# EAGLE board OpenBook-E-Book-Reader (EAGLE 9.7.0)
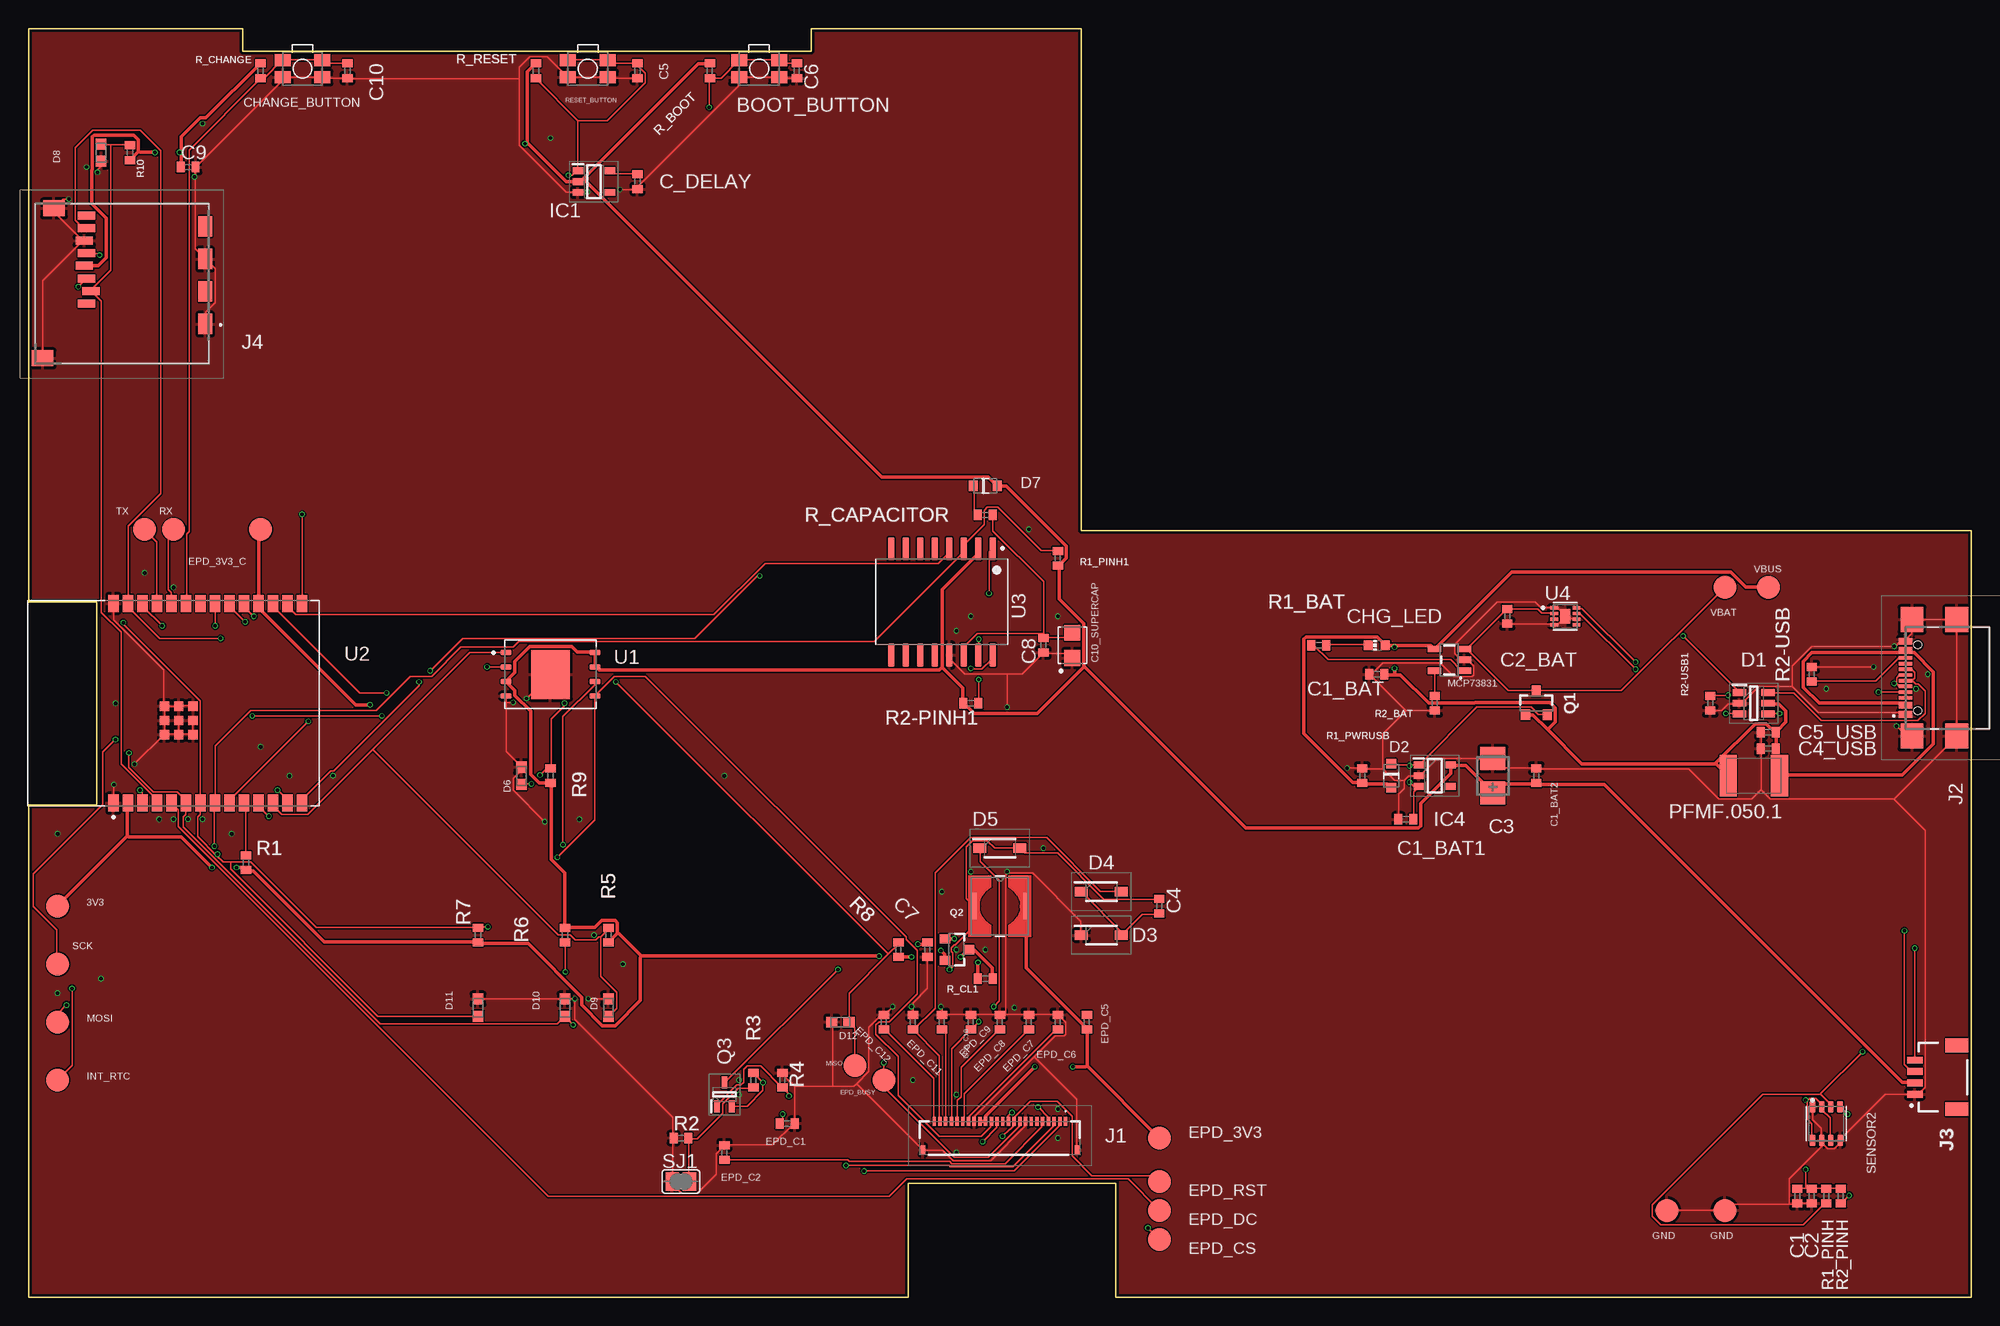
[diagram p1: board, top side]
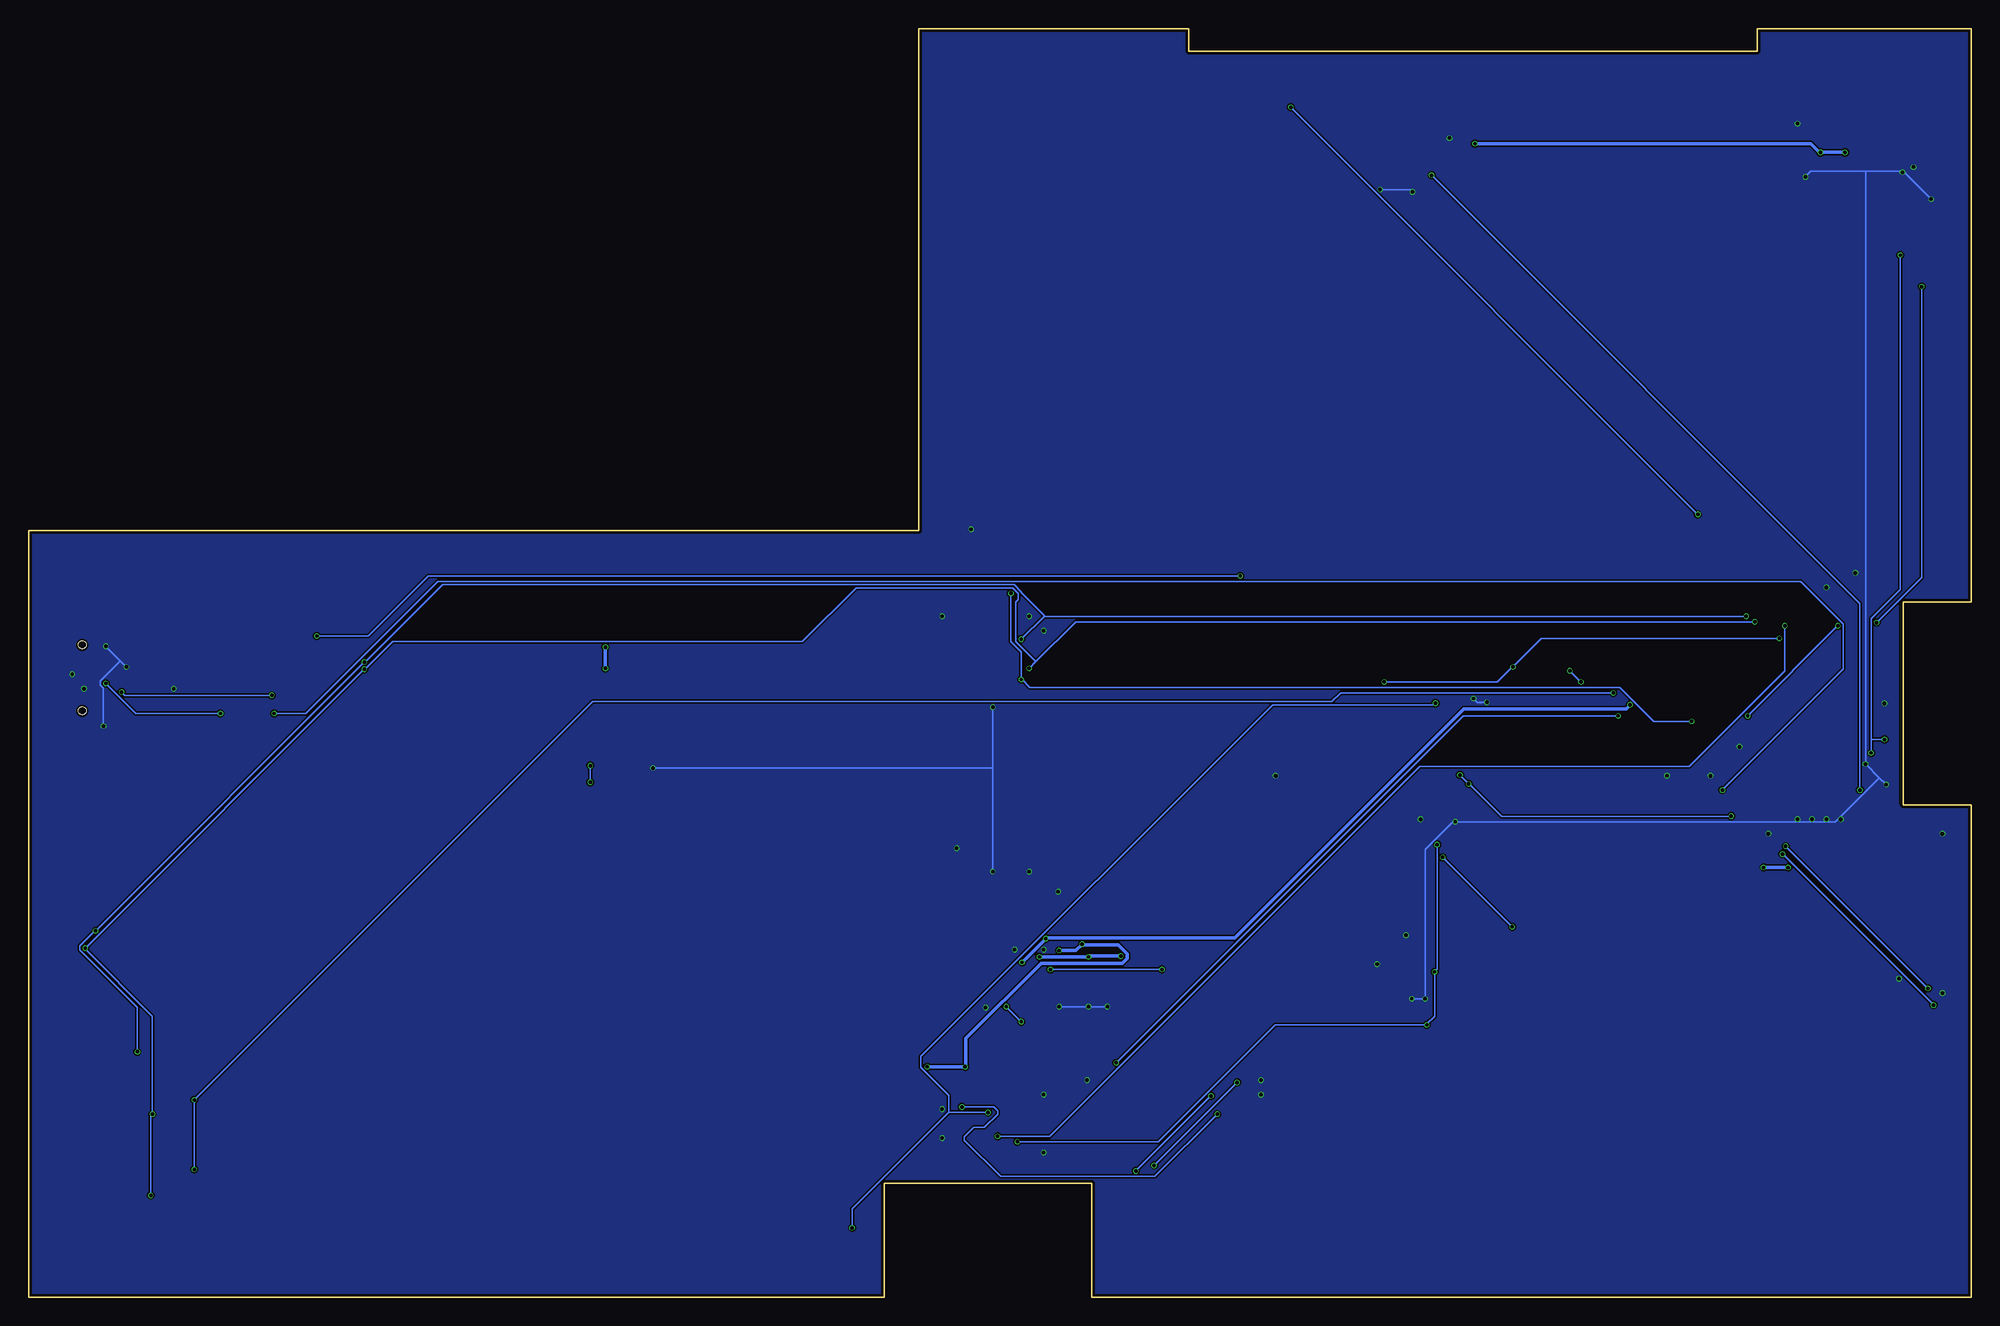
[diagram p2: board, bottom side, seen from below]

Size 170.2 x 111.2 mm. Coordinates in mm from the lower left corner, seen from the top.
Outline: 0,0 77.05,0 77.05,10 95.25,10 95.25,0 170.2,0 170.2,67.2 92.2,67.2 92.2,111.2 68.58,111.2 68.58,109.22 18.75,109.22 18.75,111.2 0,111.2 0,60.96 5.96,60.96 5.96,43.18 0,43.18 0,0
Copper layers (1*16): Top 0.035mm / dielectric 1.6mm / Bottom 0.035mm
Design rules "jlcpcb-2layers.dru *": minimum track width 0.15mm, minimum drill 0.3mm, track to track 5mil, track to pad 5mil, pad to pad 5mil, via to via 5mil, smd to smd 5mil, copper to edge 0.2mm, drill to drill 6mil, minimum pad ring 10mil, minimum via ring 3mil, stop-mask expansion 4mil, vias tented up to drill 0mil, thermal gap 10mil
Net classes: 1 ALIM: width 0.3 mm

## Footprints (pad centres in the part's own frame; a part is rotated, then mirrored left to right if it is on the bottom)
MYBUTTON = smd 1.4 x 1.05: 1 1.75,0.75; 2 -1.75,0.75; 3 -1.75,-0.75; 4 1.75,-0.75
ESP32_WROVER_EAGLE-LTSPICE_C0402 = smd 0.7 x 0.9: 1 -0.65,0; 2 0.65,0
RCL_CT3528 = smd 2 x 2.2: + -1.5,0; - 1.5,0
CAPCP3225X100N = smd 1.4 x 1.4: 1 -1.1,0; 2 1.1,0
ADAFRUIT_CHIP-LED0603 = smd 0.8 x 0.8: A 0,-0.75; C 0,0.75
SOT95P280X145-6N = smd 1.2 x 0.6: 1 -1.25,0.95; 2 -1.25,0; 3 -1.25,-0.95; 4 1.25,-0.95; 5 1.25,0; 6 1.25,0.95
ESP32_WROVER_AVX---SD0805S020S1R0_AVX_SD0805S020S1R0_0 = smd 0.8 x 0.9: 1 -1.05,0; 2 1.05,0
SOD3716X135N = smd 1.15 x 0.8: 1 -1.75,0; 2 1.75,0
DIOC1608X36N = smd 0.97 x 0.94: 1 -0.75,0; 2 0.75,0
SOT95P280X125-5N = smd 0.9 x 0.6: 1 -1.4,0.95; 2 -1.4,0; 3 -1.4,-0.95; 4 1.4,-0.95; 5 1.4,0.95
SOT95P280X120-5N = smd 0.9 x 0.6: 1 -1.4,0.95; 2 -1.4,0; 3 -1.4,-0.95; 4 1.4,-0.95; 5 1.4,0.95
FH34SRJ24S05SH99 = smd 0.3 x 0.8: 1 5.75,1.45; 2 5.25,1.45; 3 4.75,1.45; 4 4.25,1.45; 5 3.75,1.45; 6 3.25,1.45; 7 2.75,1.45; 8 2.25,1.45; 9 1.75,1.45; 10 1.25,1.45; 11 0.75,1.45; 12 0.25,1.45; 13 -0.25,1.45; 14 -0.75,1.45; 15 -1.25,1.45; 16 -1.75,1.45; 17 -2.25,1.45; 18 -2.75,1.45; 19 -3.25,1.45; 20 -3.75,1.45; 21 -4.25,1.45; 22 -4.75,1.45; 23 -5.25,1.45; 24 -5.75,1.45 | smd 0.4 x 0.8: MP1 6.75,-1.05; MP2 -6.75,-1.05
SAMACSYS_PARTS_USB4110GFA = smd 0.3 x 1.15: A1 -3.35,3.678; A4 -2.55,3.678; A5 -1.25,3.678; A6 -0.25,3.678; A7 0.25,3.678; A8 1.25,3.678; A9 2.55,3.678; A12 3.35,3.678; B1 3.05,3.678; B4 2.25,3.678; B5 1.75,3.678; B6 0.75,3.678; B7 -0.75,3.678; B8 -1.75,3.678; B9 -2.25,3.678; B12 -3.05,3.678 | smd 2.18 x 2: MP1 -5.11,-0.827; MP2 5.11,-0.827; MP3 -5.11,3.103; MP4 5.11,3.103 | hole 0.65: -2.89,2.603; 2.89,2.603
JST04_1MM_RA = smd 0.6 x 1.35: 1 -1.5,0; 2 -0.5,0; 3 0.5,0; 4 1.5,0 | smd 1.2 x 2: NC1 2.8,-3.675; NC2 -2.8,-3.675
112ATAARR03ATTEND = smd 1.8 x 1.2: G1 10.6,10.4; G2 4.9,10.4; S1 7.75,10.4; S2 2.05,10.4 | smd 1.4 x 1.9: G3 13.6,-3.85; G4 0.45,-2.85 | smd 0.7 x 1.5: P1 8.8,0; P2 7.7,0.4; P3 6.6,0; P4 5.5,-0.2; P5 4.4,0; P6 3.3,-0.2; P7 2.2,0; P8 1.1,0
IND_4828-WE-TPC_WRE = smd 0.508 x 2.286: 1 -2.286,0; 2 2.286,0
ESP32_WROVER_SPARKFUN-IC-POWER_SOT23-5 = smd 0.55 x 1.2: 1 -0.95,-1.3; 2 0,-1.3; 3 0.95,-1.3; 4 0.95,1.3; 5 -0.95,1.3
ESP32C6_VARISTOR_CT/CN1812 = smd 1.5 x 3.6: 1 -2.25,0; 2 2.25,0
ESP32_WROVER_SPARKFUN-DISCRETESEMI_SOT23-3 = smd 0.8 x 0.9: 1 -0.95,-1; 2 0.95,-1; 3 0,1.1
SOT65P210X110-3N = smd 1.05 x 0.5: 1 -1.05,0.65; 2 -1.05,-0.65; 3 1.05,0
ESP32_WROVER_EAGLE-LTSPICE_R0402 = smd 0.7 x 0.9: 1 -0.65,0; 2 0.65,0
ESP32_WROVER_BME680_PSON80P300X300X100-8N = smd 1.016 x 0.5: 1 1.458,1.2; 2 1.458,0.4; 3 1.458,-0.4; 4 1.458,-1.2; 5 -1.458,-1.22; 6 -1.458,-0.4; 7 -1.458,0.4; 8 -1.458,1.2
SJ = smd 1.168 x 1.6: 1 -0.762,0; 2 0.762,0
TP20R = smd 2 x 2: TP 0,0
SON127P600X800X80-9N = smd 0.94 x 0.44: 1 -3.895,1.905; 2 -3.895,0.635; 3 -3.895,-0.635; 4 -3.895,-1.905; 5 3.895,-1.905; 6 3.895,-0.635; 7 3.895,0.635; 8 3.895,1.905 | smd 3.4 x 4.3: 9 0,0
XCVR_ESP32-C6-WROOM-1-N8 = smd 1.5 x 0.9: 1 -8.75,5.26; 2 -8.75,3.99; 3 -8.75,2.72; 4 -8.75,1.45; 5 -8.75,0.18; 6 -8.75,-1.09; 7 -8.75,-2.36; 8 -8.75,-3.63; 9 -8.75,-4.9; 10 -8.75,-6.17; 11 -8.75,-7.44; 12 -8.75,-8.71; 13 -8.75,-9.98; 14 -8.75,-11.25; 15 8.75,-11.25; 16 8.75,-9.98; 17 8.75,-8.71; 18 8.75,-7.44; 19 8.75,-6.17; 20 8.75,-4.9; 21 8.75,-3.63; 22 8.75,-2.36; 23 8.75,-1.09; 24 8.75,0.18; 25 8.75,1.45; 26 8.75,2.72; 27 8.75,3.99; 28 8.75,5.26 | smd 0.8 x 0.8: 29_1 -2.755,0.79; 29_2 -1.505,0.79; 29_3 -0.255,0.79; 29_4 -2.755,-0.46; 29_5 -1.505,-0.46; 29_6 -0.255,-0.46; 29_7 -2.755,-1.71; 29_8 -1.505,-1.71; 29_9 -0.255,-1.71
SOIC127P1032X265-16N = smd 2.05 x 0.59: 1 -4.655,4.445; 2 -4.655,3.175; 3 -4.655,1.905; 4 -4.655,0.635; 5 -4.655,-0.635; 6 -4.655,-1.905; 7 -4.655,-3.175; 8 -4.655,-4.445; 9 4.655,-4.445; 10 4.655,-3.175; 11 4.655,-1.905; 12 4.655,-0.635; 13 4.655,0.635; 14 4.655,1.905; 15 4.655,3.175; 16 4.655,4.445
SON50P200X200X80-9N = smd 0.76 x 0.27: 1 -0.985,0.75; 2 -0.985,0.25; 3 -0.985,-0.25; 4 -0.985,-0.75; 5 0.985,-0.75; 6 0.985,-0.25; 7 0.985,0.25; 8 0.985,0.75 | smd 0.9 x 1.3: 9 0,0

## Placement (x,y rotation side)
BOOT_BUTTON  BUTTON_CUSYOMV1  [MYBUTTON]  64,107.67 180 top
C1  100nF  [ESP32_WROVER_EAGLE-LTSPICE_C0402]  154.94,8.89 270 top
C1_BAT  4.7uF  [ESP32_WROVER_EAGLE-LTSPICE_C0402]  118.11,54.61 180 top
C1_BAT1  4.7uF  [ESP32_WROVER_EAGLE-LTSPICE_C0402]  120.65,41.91 180 top
C1_BAT2  4.7uF  [ESP32_WROVER_EAGLE-LTSPICE_C0402]  132.08,45.72 90 top
C2  100nF  [ESP32_WROVER_EAGLE-LTSPICE_C0402]  156.21,8.89 270 top
C2_BAT  4.7uF  [ESP32_WROVER_EAGLE-LTSPICE_C0402]  129.54,59.69 270 top
C3  100uF TANT  [RCL_CT3528]  128.27,45.72 90 top
C4  4.7uF/25V  [ESP32_WROVER_EAGLE-LTSPICE_C0402]  99.06,34.29 90 top
C4_USB  100nF  [ESP32_WROVER_EAGLE-LTSPICE_C0402]  152.4,48.1 180 top
C5  1uF  [ESP32_WROVER_EAGLE-LTSPICE_C0402]  53.34,107.5 270 top
C5_USB  4.7uF  [ESP32_WROVER_EAGLE-LTSPICE_C0402]  152.4,49.53 180 top
C6  100nF  [ESP32_WROVER_EAGLE-LTSPICE_C0402]  67.31,107.5 270 top
C7  10uF  [ESP32_WROVER_EAGLE-LTSPICE_C0402]  78.74,30.48 270 top
C8  100nF  [ESP32_WROVER_EAGLE-LTSPICE_C0402]  88.9,57.15 270 top
C9  100nF  [ESP32_WROVER_EAGLE-LTSPICE_C0402]  13.98,99.06 0 top
C10  100nF  [ESP32_WROVER_EAGLE-LTSPICE_C0402]  27.94,107.5 270 top
C10_SUPERCAP  CPH3225A  [CAPCP3225X100N]  91.44,57.15 90 top
C_DELAY  100nF  [ESP32_WROVER_EAGLE-LTSPICE_C0402]  53.34,97.79 270 top
CHANGE_BUTTON  BUTTON_CUSYOMV1  [MYBUTTON]  24,107.67 180 top
CHG_LED  [ADAFRUIT_CHIP-LED0603]  118.11,57.15 90 top
D1  USBLC6-2SC6Y  [SOT95P280X145-6N]  151.13,52.07 0 top
D2  ESP32_WROVER_AVX---SD0805S020S1R0_AVX_SD0805S020S1R0_0_0AVX_SD0805S020S1R0_0_0  [ESP32_WROVER_AVX---SD0805S020S1R0_AVX_SD0805S020S1R0_0]  119.38,45.72 270 top
D3  MBR0530  [SOD3716X135N]  93.98,31.75 0 top
D4  MBR0530  [SOD3716X135N]  93.98,35.56 0 top
D5  MBR0530  [SOD3716X135N]  85.09,39.37 0 top
D6  PGB1010603MR  [DIOC1608X36N]  43.18,45.72 90 top
D7  ESP32_WROVER_AVX---SD0805S020S1R0_AVX_SD0805S020S1R0_0_0AVX_SD0805S020S1R0_0_0  [ESP32_WROVER_AVX---SD0805S020S1R0_AVX_SD0805S020S1R0_0]  83.82,71.12 0 top
D8  PGB1010603MR  [DIOC1608X36N]  6.35,100.33 270 top
D9  PGB1010603MR  [DIOC1608X36N]  50.8,25.4 90 top
D10  PGB1010603MR  [DIOC1608X36N]  46.99,25.4 90 top
D11  PGB1010603MR  [DIOC1608X36N]  39.37,25.4 90 top
D12  PGB1010603MR  [DIOC1608X36N]  71.12,24.13 180 top
EPD_C1  1uF/50V  [ESP32_WROVER_EAGLE-LTSPICE_C0402]  66.45,15.24 0 top
EPD_C2  1uF/50V  [ESP32_WROVER_EAGLE-LTSPICE_C0402]  60.96,12.7 90 top
EPD_C5  0.1uF/50V  [ESP32_WROVER_EAGLE-LTSPICE_C0402]  92.71,24.13 90 top
EPD_C6  1uF/50V  [ESP32_WROVER_EAGLE-LTSPICE_C0402]  90.17,24.13 90 top
EPD_C7  1uF/50V  [ESP32_WROVER_EAGLE-LTSPICE_C0402]  87.63,24.13 90 top
EPD_C8  1uF/50V  [ESP32_WROVER_EAGLE-LTSPICE_C0402]  85.09,24.13 90 top
EPD_C9  1uF/50V  [ESP32_WROVER_EAGLE-LTSPICE_C0402]  82.55,24.13 90 top
EPD_C10  1uF/50V  [ESP32_WROVER_EAGLE-LTSPICE_C0402]  80.01,24.13 90 top
EPD_C11  1uF/50V  [ESP32_WROVER_EAGLE-LTSPICE_C0402]  77.47,24.13 90 top
EPD_C12  1uF/50V  [ESP32_WROVER_EAGLE-LTSPICE_C0402]  74.93,24.13 90 top
IC1  BD5229G-TR  [SOT95P280X125-5N]  49.53,97.79 0 top
IC4  XC6220A331MR-G  [SOT95P280X120-5N]  123.19,45.72 0 top
J1  FH34SRJ-24S-0.5SH_99_  [FH34SRJ24S05SH99]  85.09,13.97 0 top
J2  SAMACSYS_PARTS_USB4110-GF-A  [SAMACSYS_PARTS_USB4110GFA]  168.1,54.3 90 top
J3  QWIIC_RIGHT_ANGLE  [JST04_1MM_RA]  165.25,19.3 90 top
J4  112A-TAAR-R03_ATTEND  [112ATAARR03ATTEND]  5.08,95.9 270 top
L1  68uH  [IND_4828-WE-TPC_WRE]  85.09,34.29 0 top
MCP73831  ESP32_WROVER_SPARKFUN-IC-POWER_MCP73831  [ESP32_WROVER_SPARKFUN-IC-POWER_SOT23-5]  124.46,55.88 90 top
PFMF.050.1  ESP32C6_VARISTORCN1812  [ESP32C6_VARISTOR_CT/CN1812]  151.13,45.72 180 top
Q1  20V/4.2A/52mΩ/1.4W  [ESP32_WROVER_SPARKFUN-DISCRETESEMI_SOT23-3]  132.08,52.07 0 top
Q2  20V/4.2A/52mΩ/1.4W  [ESP32_WROVER_SPARKFUN-DISCRETESEMI_SOT23-3]  81.28,30.48 270 top
Q3  SI1308EDL-T1-GE3  [SOT65P210X110-3N]  60.96,17.78 90 top
R1  10K  [ESP32_WROVER_EAGLE-LTSPICE_R0402]  19.05,38.1 90 top
R1_BAT  200  [ESP32_WROVER_EAGLE-LTSPICE_R0402]  113.03,57.15 0 top
R1_PINH  10K  [ESP32_WROVER_EAGLE-LTSPICE_R0402]  157.48,8.89 90 top
R1_PINH1  10K  [ESP32_WROVER_EAGLE-LTSPICE_R0402]  90.17,64.77 270 top
R1_PWRUSB  100K  [ESP32_WROVER_EAGLE-LTSPICE_R0402]  116.84,45.72 270 top
R2  2.2  [ESP32_WROVER_EAGLE-LTSPICE_R0402]  57.15,13.97 0 top
R2-PINH1  10K  [ESP32_WROVER_EAGLE-LTSPICE_R0402]  82.55,52.07 180 top
R2-USB  5k1  [ESP32_WROVER_EAGLE-LTSPICE_R0402]  156.21,54.61 90 top
R2-USB1  5k1  [ESP32_WROVER_EAGLE-LTSPICE_R0402]  147.32,52.07 90 top
R2_BAT  2K  [ESP32_WROVER_EAGLE-LTSPICE_R0402]  123.19,52.07 90 top
R2_PINH  10K  [ESP32_WROVER_EAGLE-LTSPICE_R0402]  158.75,8.89 90 top
R3  0.47  [ESP32_WROVER_EAGLE-LTSPICE_R0402]  63.5,19.05 270 top
R4  10K  [ESP32_WROVER_EAGLE-LTSPICE_R0402]  66.04,19.05 90 top
R5  10K  [ESP32_WROVER_EAGLE-LTSPICE_R0402]  50.8,31.75 90 top
R6  10K  [ESP32_WROVER_EAGLE-LTSPICE_R0402]  46.99,31.75 90 top
R7  10K  [ESP32_WROVER_EAGLE-LTSPICE_R0402]  39.37,31.75 270 top
R8  10K  [ESP32_WROVER_EAGLE-LTSPICE_R0402]  76.2,30.48 270 top
R9  10K  [ESP32_WROVER_EAGLE-LTSPICE_R0402]  45.72,45.72 270 top
R10  10K  [ESP32_WROVER_EAGLE-LTSPICE_R0402]  8.89,100.33 270 top
R_BOOT  10K  [ESP32_WROVER_EAGLE-LTSPICE_R0402]  59.69,107.5 270 top
R_CAPACITOR  15  [ESP32_WROVER_EAGLE-LTSPICE_R0402]  83.82,68.58 180 top
R_CHANGE  10K  [ESP32_WROVER_EAGLE-LTSPICE_R0402]  20.32,107.5 270 top
R_CL1  10K  [ESP32_WROVER_EAGLE-LTSPICE_R0402]  83.82,27.94 180 top
R_RESET  10K  [ESP32_WROVER_EAGLE-LTSPICE_R0402]  44.45,107.5 270 top
RESET_BUTTON  BUTTON_CUSYOMV1  [MYBUTTON]  49,107.67 180 top
SENSOR2  BME688  [ESP32_WROVER_BME680_PSON80P300X300X100-8N]  157.48,15.24 90 top
SJ1  [SJ]  57.15,10.16 0 top
TP1  TPTP20R  [TP20R]  10.16,67.31 0 top
TP2  TPTP20R  [TP20R]  12.7,67.31 0 top
TP3  TPTP20R  [TP20R]  148.59,62.23 0 top
TP4  TPTP20R  [TP20R]  148.59,7.62 0 top
TP5  TPTP20R  [TP20R]  143.51,7.62 0 top
TP6  TPTP20R  [TP20R]  72.39,20.32 0 top
TP7  TPTP20R  [TP20R]  2.54,24.13 0 top
TP8  TPTP20R  [TP20R]  2.54,29.21 0 top
TP9  TPTP20R  [TP20R]  74.93,19.05 0 top
TP10  TPTP20R  [TP20R]  99.06,5.09 0 top
TP11  TPTP20R  [TP20R]  99.06,7.62 0 top
TP12  TPTP20R  [TP20R]  99.06,10.16 0 top
TP13  TPTP20R  [TP20R]  20.32,67.31 0 top
TP14  TPTP20R  [TP20R]  152.4,62.23 0 top
TP15  TPTP20R  [TP20R]  2.54,19.05 0 top
TP16  TPTP20R  [TP20R]  2.54,34.29 0 top
TP17  TPTP20R  [TP20R]  99.06,13.97 0 top
U1  W25Q512JVEIQ  [SON127P600X800X80-9N]  45.72,54.61 0 top
U2  ESP32-C6-WROOM-1-N8  [XCVR_ESP32-C6-WROOM-1-N8]  12.7,52.07 90 top
U3  DS3231SN#  [SOIC127P1032X265-16N]  80.01,60.96 270 top
U4  MAX17048G+T10  [SON50P200X200X80-9N]  134.62,59.69 0 top

## Tracks (layer width: path | path; a pad name or v marks a point on that pad's centre or on a via)
3V3  (via drill 0.3)
  Top 0.3: 43.7,101.17 43.7,107.41 44.39,108.1 R_RESET.1 | 43.7,101.17 47.09,97.78 IC1.2 48.27,97.71 48.58,98.02 | 48.58,98.02 58.66,108.1 59.62,108.1 R_BOOT.1 | 9.63,100.41 8.93,99.72 R10.2 | 9.63,100.41 9.63,101.45 9.21,101.87 5.75,101.87 5.58,101.7 5.58,98.85 5.54,98.81 5.54,95.84 6.79,94.6 6.79,91.13 6.09,90.44 4.92,90.44 J4.P4 | 13.37,100.34 13.37,99.1 C9.1 | v11.08,100.34 9.76,100.34 9.63,100.41 | v13.23,100.34 13.37,100.34 | v43.49,101.11 43.56,101.11 43.7,101.17 | J3.2 165.23,18.84 164.12,18.84 138.01,44.94 132.2,44.94 C1_BAT2.1 132.06,45.01 129.08,45.01 128.39,44.32 C3.+ 128.25,44.25 125.9,46.6 124.65,46.6 IC4.5 124.58,46.47 124.58,45.91 121.95,43.28 121.95,41.34 121.74,41.13 106.64,41.13 92.59,55.19 92.45,55.26 | 8.66,40.44 8.66,43.28 U2.2 | 8.66,40.44 2.56,34.35 TP16.TP | v16.07,37.67 13.37,40.37 8.79,40.37 8.66,40.44 | v18.21,37.67 18.7,37.67 18.91,37.46 R1.1 19.11,37.4 19.67,37.4 25.9,31.16 39.33,31.16 R7.2 39.47,31.02 43.77,31.02 48.48,26.32 48.48,25.62 50.28,23.82 51.38,23.82 53.6,26.04 53.6,29.78 53.67,29.92 | 80.05,55.19 81.85,53.39 81.85,52.08 R2-PINH1.2 81.99,52.01 82.82,51.18 88.36,51.18 92.45,55.26 | 80.05,55.19 80.05,62.05 83.17,65.16 83.17,65.58 U3.2 | 92.45,55.26 92.45,59.07 90.3,61.22 90.3,63.99 R1_PINH1.2 90.23,64.13 90.92,64.82 90.92,65.86 85.66,71.12 84.9,71.12 D7.2 84.76,71.19 84.07,71.88 74.72,71.88 48.58,98.02 | v77.35,29.85 76.24,29.85 R8.2 | v81.65,29.85 82.34,30.54 Q2.3 82.48,30.4 82.89,30.4 84.42,28.88 84.42,27.98 R_CL1.1 | 51.59,31.92 51.59,32.83 51.38,33.03 50.21,33.03 49.58,32.41 47.02,32.41 R6.2 46.95,32.55 46.95,37.19 45.77,38.36 45.77,44.94 R9.2 45.7,45.08 44.74,45.08 43.97,45.84 43.97,51.38 42.59,52.77 42.59,53.18 41.83,53.95 U1.3 41.9,54.08 42.59,54.78 42.59,55.75 43.9,57.06 47.58,57.06 48.06,56.58 49.51,56.58 U1.8 49.65,56.51 49.65,55.26 U1.7 49.79,55.19 50,54.98 79.78,54.98 79.92,55.12 80.05,55.19
  Top 0.3: 51.59,31.92 50.83,31.16 R5.1 | 53.67,29.92 v74.51,29.92 | 53.67,29.92 51.73,31.86 51.59,31.92 | R_CHANGE.1 15.54,103.37 15.03,103.37 13.37,101.71 13.37,100.34
  Bottom 0.3: v11.08,100.34 v13.23,100.34 13.37,100.41 14.06,101.11 v43.49,101.11 | v18.21,37.67 v16.07,37.67 | v81.65,29.85 v77.35,29.85 77.21,29.92 v74.51,29.92
32KHZ  (via drill 0.3)
  Top 0.15: v83.24,54.15 83.24,52.08 R2-PINH1.1 | v84.14,61.7 84.14,65.3 84.42,65.58 U3.1 | v24.52,50.48 17.66,43.63 17.66,43.35 U2.9
  Bottom 0.15: v84.14,61.7 84.14,57.48 83.24,56.58 v83.24,54.15 83.17,54.15 82.48,53.46 30.82,53.46 27.84,50.48 v24.52,50.48
DN  (via drill 0.3)
  Top 0.15: 163.64,53.81 163.84,53.6 164.4,53.6 J2.B7 | 163.64,53.81 163.64,54.29 163.84,54.5 164.4,54.5 J2.A7 | v153.39,51.18 152.42,51.18 D1.4 | 163.64,53.81 v163.43,53.81
  Bottom 0.15: v153.39,51.18 160.8,51.18 v163.43,53.81
DP
  Top 0.15: 165.02,54.08 164.47,54.08 J2.A6 | 165.02,54.08 165.23,54.29 165.23,54.78 165.02,54.98 164.47,54.98 J2.B6 | D1.6 152.42,52.98 154.63,52.98 157.06,50.55 165.51,50.55 166.13,51.18 166.13,53.16 165.52,53.77 165.34,53.77 165.02,54.08
EPD_3V3  (via drill 0.3)
  Top 0.3: v79.92,30.4 80.26,30.05 80.26,29.57 Q2.2 | v77.91,30.95 78.6,30.95 78.74,31.09 C7.1 | J1.16 83.38,15.44 83.79,15.44 J1.15 83.86,15.58 83.86,15.93 v88.16,20.22 | 92.73,20.29 92.73,23.48 EPD_C5.1 92.66,23.61 87.39,28.88 87.39,34.28 L1.2 | 92.73,20.29 99.03,13.99 TP17.TP | v91.48,20.22 92.59,20.22 92.73,20.29
  Bottom 0.3: v79.92,30.4 78.46,30.4 v77.91,30.95 77.77,30.89 74.72,30.89 73.96,30.12 73.96,29.71 74.37,29.29 81.51,29.29 88.09,22.71 88.09,20.36 v88.16,20.22 v91.48,20.22
EPD_3V3_C  (via drill 0.3)
  Top 0.3: v83.17,29.36 83.17,27.98 R_CL1.2 | v81.09,31.44 80.33,31.44 Q2.1 | TP13.TP 20.29,67.24 20.15,67.1 20.15,60.87 U2.18 20.22,60.73 20.22,60.39 28.67,51.94 v29.92,51.94
  Bottom 0.3: v83.17,29.36 v81.09,31.44 80.95,31.51 64.54,31.51 44.46,51.59 30.26,51.59 v29.92,51.94
EPD_BUSY  (via drill 0.3)
  Top 0.15: J1.9 86.84,15.37 86.84,15.03 84.08,12.27 81.1,12.27 75,18.38 75,19.04 TP9.TP 74.93,19.11 v74.93,20.57 | v11.7,58.86 10.04,60.52 10.04,60.8 U2.26 | v30.95,50.97 v19.6,50.97
  Bottom 0.15: v19.6,50.97 v11.7,58.86 | v30.95,50.97 44.53,50.97 v74.93,20.57
EPD_CS  (via drill 0.3)
  Top 0.15: J1.12 85.39,15.44 85.8,15.44 J1.11 85.8,15.51 85.8,15.86 v86.15,16.2 | v98.06,6.09 99.03,5.12 TP10.TP | v44.8,45.77 45.36,46.33 45.7,46.33 R9.1 45.77,46.4 45.77,50.69 46.95,51.87 v46.95,52.08 | v44.04,45.01 43.21,45.01 D6.1 | v21.05,42.17 20.15,43.07 20.15,43.28 U2.11
  Bottom 0.15: 89.61,16.2 v86.15,16.2 | 89.61,16.2 98.06,7.76 v98.06,6.09 | v44.8,45.77 v44.04,45.01 43.97,45.01 41.13,42.17 v21.05,42.17 | 89.61,16.2 89.61,17.73 92.03,20.15 92.03,21.12 61.22,51.94 47.09,51.94 v46.95,52.08
EPD_DC
  Top 0.15: TP11.TP 99.03,7.69 96.33,10.39 76.94,10.39 75.41,8.86 45.52,8.86 13.13,41.26 13.13,42.71 U2.5
EPD_RST  (via drill 0.3)
  Top 0.15: TP12.TP 99.03,10.18 98.54,10.66 93.14,10.66 91.41,12.4 91.41,15.88 90.11,17.17 87.74,17.17 86.36,15.79 86.36,15.44 J1.10 86.28,15.37 86.28,15.03 86.01,14.75 85.94,14.75 v85.32,14.13 | v16.34,58.86 16.34,60.8 U2.21
  Bottom 0.15: v16.34,58.86 16.34,54.91 24.72,46.54 48.34,46.54 80.75,14.13 v85.32,14.13
FLASH_CS
  Top 0.15: 50.14,31.58 50.76,32.2 50.76,32.34 R5.2 | 50.14,31.58 50.14,28.12 51.52,26.73 51.52,25.35 50.83,24.65 D9.1 | 30.16,48.02 24.45,42.31 22.16,42.31 21.47,43 21.47,43.28 U2.12 | 30.16,48.02 38.64,56.51 41.76,56.51 U1.1 | 30.16,48.02 46.4,31.79 47.44,31.79 47.9,31.32 49.71,31.32 49.96,31.58 50.14,31.58
GDR  (via drill 0.3)
  Top 0.15: v73.2,11.08 86.36,11.08 90.3,15.03 90.3,15.37 J1.2 | v66.62,17.66 66.62,17.8 66.06,18.35 R4.1 66,18.42 64.13,20.29 62.95,20.29 62.66,20 62.66,18.87 62.41,18.62 62.05,18.62 60.32,16.89 60.32,16.76 Q3.1
  Bottom 0.15: v66.62,17.66 v73.2,11.08
GND  (via drill 0.3, 0.35)
  Top 0.15: 120.5,45.29 120.5,44.6 120.01,44.11 120.01,41.97 C1_BAT1.2 | 120.5,45.29 120.91,45.7 121.74,45.7 IC4.2 121.81,45.77 121.95,45.77 123.4,47.23 128.25,47.23 C3.- 128.32,47.16 129.08,46.4 132.06,46.4 C1_BAT2.2 132.13,46.33 145.43,46.33 148.06,43.7 150.97,43.7 151.73,44.46 151.8,44.46 | 118.62,46.33 116.89,46.33 R1_PWRUSB.1 116.83,46.4 v115.51,46.4 | 118.62,46.33 119.66,45.29 120.5,45.29 | U4.9 134.62,59.62 134,59 133.65,59 U4.4 133.58,59 129.57,59 C2_BAT.2 | U4.9 134.62,59.76 134,60.39 133.65,60.39 U4.1 133.58,60.45 132.47,60.45 131.99,60.94 128.67,60.94 124.93,57.2 124.93,56.44 125.48,55.88 125.69,55.88 MCP73831.2 125.83,55.82 126.1,55.82 126.59,55.33 126.59,54.57 126.45,54.43 124.86,54.43 123.68,55.61 118.62,55.61 117.59,54.57 C1_BAT.2 117.52,54.57 120.63,51.45 | U4.6 135.59,59.49 134.83,59.49 134.69,59.62 U4.9 | 120.63,51.45 123.13,51.45 R2_BAT.1 | 118.62,46.33 118.62,49.38 120.63,51.38 120.63,51.45 | SENSOR2.7 157.13,13.78 157.13,13.5 157.61,13.02 158.17,13.02 158.65,13.5 158.65,13.78 SENSOR2.5 158.72,13.85 162.67,17.8 165.23,17.8 J3.1 165.3,17.87 165.58,17.87 166.13,18.42 166.13,40.93 163.43,43.63 163.43,43.7 | SENSOR2.1 156.3,16.69 156.3,15.58 157.06,14.82 157.06,13.85 SENSOR2.7 | C2.2 156.16,8.24 154.98,8.24 C1.2 154.91,8.17 154.22,8.17 | 154.22,8.17 149.09,8.17 148.61,7.69 TP4.TP 148.54,7.62 143.56,7.62 TP5.TP | 154.22,8.17 154.22,10.39 157.2,13.37 SENSOR2.7 | C5_USB.2 151.8,49.51 151.8,48.13 C4_USB.2 151.8,48.06 151.8,44.46 | 151.8,44.46 152.56,43.7 163.43,43.7 | 163.43,43.7 168.9,49.17 J2.MP1 168.9,49.24 168.9,59.35 J2.MP2 168.9,59.42 165.02,59.42 J2.MP4 164.95,59.35 164.95,58.17 164.47,57.69 J2.A12 164.4,57.62 164.4,57.41 J2.B1 164.4,57.34 163.84,57.34 163.57,57.06 v163.43,57.06 156.23,57.06 154.5,55.33 154.5,53.53
  Top 0.15: J2.A1 164.4,50.97 164.4,51.24 J2.B12 164.33,51.24 156.78,51.24 154.5,53.53 | R2-USB1.1 147.36,51.45 148.33,51.45 148.89,52.01 149.86,52.01 D1.2 149.93,52.08 150.13,52.08 151.59,53.53 154.5,53.53 | v161.63,55.26 156.23,55.26 R2-USB.2 | v163.64,50.07 164.47,49.24 164.95,49.24 J2.MP3 | C6.2 67.24,106.85 65.79,106.85 BOOT_BUTTON.2 65.72,106.92 BOOT_BUTTON.1 62.19,106.85 62.19,106.16 53.39,97.36 53.39,97.16 C_DELAY.2 53.32,97.09 v51.8,97.09 | v3.53,96.26 3.05,96.26 2.29,95.5 J4.G4 2.29,95.43 2.29,95.08 4.71,92.66 4.85,92.66 J4.P6 4.71,92.59 1.25,89.12 1.25,82.34 J4.G3 | D8.2 6.3,99.51 6.3,99.03 6.04,98.77 v6.04,98.6 | C5.2 53.32,106.85 50.76,106.85 RESET_BUTTON.2 50.69,106.92 47.3,106.92 RESET_BUTTON.1 47.23,106.92 45.43,108.72 43.9,108.72 43,107.82 43,106.78 | 43,106.78 43,100.97 47.09,96.88 48.13,96.88 IC1.3 48.2,96.88 v48.96,96.88 | 14.61,98.2 14.61,91.89 15.44,91.06 J4.G2 15.51,91 16.34,90.16 16.34,87.19 15.51,86.36 15.51,85.32 J4.G1 | 14.61,98.2 14.61,99.03 C9.2 14.68,99.1 22.23,106.64 22.23,106.85 CHANGE_BUTTON.1 22.3,106.92 25.69,106.92 CHANGE_BUTTON.2 25.76,106.85 27.91,106.85 C10.2 27.98,106.78 43,106.78 | v14.54,98.2 14.61,98.2 | 88.12,21.09 89.96,22.92 90.72,22.92 90.86,23.06 90.86,24.1 90.23,24.72 EPD_C6.2 90.16,24.79 87.67,24.79 EPD_C7.2 87.6,24.79 85.59,24.79 | 88.12,21.09 82.89,15.86 82.89,15.44 J1.17 | 88.12,21.09 91.83,17.38 91.83,12.95 J1.MP1 | C10_SUPERCAP.1 91.41,56.09 91.06,56.44 88.92,56.44 C8.2 88.85,56.44 87.05,54.64 85.73,54.64 | 85.73,54.64 81.99,54.64 80.68,55.95 80.68,56.3 U3.13 | 85.59,24.79 85.11,24.79 EPD_C8.2 85.04,24.79 82.61,24.79 EPD_C9.2 82.55,24.79 80.05,24.79 EPD_C10.2 80.05,24.86 80.05,25.35 v79.92,25.48
  Top 0.15: 85.73,37.19 87.95,37.19 92.17,32.96 92.17,31.79 D3.1 | 85.73,37.19 85.59,37.05 85.59,24.79 | v85.73,51.73 85.73,54.64 | v85.73,37.33 85.73,37.19 | U2.29_9 14.4,51.87 13.23,51.87 U2.29_6 13.09,51.8 11.98,51.8 U2.29_3 | U2.29_1 11.91,49.38 U2.29_2 11.91,50.62 11.91,51.8 U2.29_3 | U2.29_4 13.16,49.38 11.98,49.38 U2.29_1 | U2.29_5 13.16,49.44 U2.29_4 | U2.29_4 13.23,49.38 14.4,49.38 U2.29_7 14.4,49.44 U2.29_8 | v7.48,44.94 7.48,43.35 U2.1 | v9.28,46.74 11.84,49.31 U2.29_1 | U2.28 7.48,60.8 7.48,59.35 11.84,54.98 11.84,51.87 U2.29_3 | 41.83,52.15 41.83,47.85 43.14,46.54 D6.2 43.14,46.47 43.14,46.19 42.45,45.5 42.45,44.46 v45.22,41.69 | 41.83,52.15 U1.4 | v42.45,52.15 41.83,52.15 | v43.63,52.49 45.7,54.57 U1.9 | D11.2 39.4,26.18 46.95,26.18 D10.2 47.02,26.18 v47.85,26.18 47.85,24.38 56.44,15.79 56.44,13.99 R2.1 56.44,13.92 56.44,10.18 SJ1.1 56.44,10.11 56.44,9.9 57.2,9.14 58.59,9.14 60.25,10.8 60.25,12.6 60.94,13.3 EPD_C2.2 61.01,13.37 65.16,13.37 67.03,15.23 EPD_C1.2 67.1,15.3 67.1,18.49 | v49.03,26.18 50.76,26.18 D9.2 | J1.8 87.32,15.37 87.32,15.03 84.29,11.99 80.99,11.99 80.1,12.88 78.39,12.88 J1.MP2 78.32,12.95 72.54,18.73 | 77.49,25.48 77.49,25.83 78.74,27.08 78.74,29.78 C7.2 | 77.49,25.48 77.49,24.79 EPD_C11.2 | 67.1,18.49 66.06,19.53 66.06,19.67 R4.2 | 72.54,18.73 72.3,18.49 70.43,18.49 | 72.54,18.73 73.61,19.8 73.61,23.68 74.65,24.72 74.93,24.72 EPD_C12.2 75,24.79 v75.69,25.48 | 67.1,18.49 70.43,18.49 | 70.43,18.49 70.43,24.1 D12.2 | v77.35,25.48 77.49,25.48
  Bottom 0.15: v163.43,57.06 162.15,55.78 | 162.15,55.78 v161.63,55.26 | v163.64,50.07 163.64,53.39 163.91,53.67 163.91,54.02 162.15,55.78 | v3.53,96.26 5.96,98.68 | 9.28,98.68 14.06,98.68 v14.54,98.2 | 9.28,98.68 5.96,98.68 | v51.8,97.09 49.17,97.09 v48.96,96.88 | v85.73,37.33 85.73,46.4 | 85.73,46.4 v85.73,51.73 | 8.07,45.53 v9.28,46.74 9.28,98.68 | 8.07,45.53 v7.48,44.94 | v42.45,52.15 43.28,52.15 v43.63,52.49 | v49.03,26.18 v47.85,26.18 47.85,39.27 45.43,41.69 v45.22,41.69 11.91,41.69 8.07,45.53 | v75.69,25.48 v77.35,25.48 v79.92,25.48 | 85.73,46.4 v115.51,46.4 | 5.96,98.68 v6.04,98.6
  other vias: 60.96,45.72 48.26,41.91 52.07,29.21 22.86,45.72 20.32,48.26 17.78,40.64 11.43,41.91 2.54,40.64 7.62,52.07 10.16,63.5 12.7,62.23 45.72,101.6 15.24,102.87 5.08,99.06 80.01,35.56 83.82,30.48 49.53,31.75 81.28,12.7 77.47,19.05 90.17,59.69 87.63,67.31 26.67,45.72 157.48,53.34 166.37,54.61 165.35,53.34 15.24,41.91 13.97,41.91 12.7,41.91 82.55,37.31 88.9,39.37 90.17,16.51 81.28,17.78 62.23,17.78 62.23,19.05 81.28,58.42 82.55,59.69 86.36,25.4 81.28,30.48 90.17,13.97 2.54,26.67 6.35,27.94
  pour Top: 0.08,-0.02 0.06,-0.04 -1.09,-1.19 77.39,-1.19 77.39,10.18 77.41,10.2 77.43,10.22 77.45,10.24 95.27,10.24 95.29,10.22 95.31,10.2 95.33,10.18 95.33,0.08 170.1,0.08 170.1,67.23 92.69,67.23 92.67,67.25 92.65,67.27 92.63,67.29 92.63,111.68 68.66,111.68 68.66,109.2 68.64,109.18 68.62,109.16 68.6,109.14 19.03,109.14 19.01,109.16 18.99,109.18 18.97,109.2 18.97,111.68 0.08,111.68 0.08,61.04 6.37,61.04 6.39,61.02 6.41,61 6.43,60.98 6.43,43.16 6.41,43.14 6.39,43.12 6.37,43.1 0.08,43.1
  pour Bottom: 77.43,10.22 77.45,10.24 95.27,10.24 95.29,10.22 95.31,10.2 95.33,10.18 95.33,0.08 170.1,0.08 170.1,67.23 92.69,67.23 92.67,67.25 92.65,67.27 92.63,67.29 92.63,111.68 68.66,111.68 68.66,109.2 68.64,109.18 68.62,109.16 68.6,109.14 19.03,109.14 19.01,109.16 18.99,109.18 18.97,109.2 18.97,111.68 0.08,111.68 0.08,61.04 6.37,61.04 6.39,61.02 6.41,61 6.43,60.98 6.43,43.16 6.41,43.14 6.39,43.12 6.37,43.1 0.08,43.1 0.08,0.08 77.39,0.08 77.39,10.18 77.41,10.2
GPIO8
  Top 0.15: R1.2 19.04,38.78 19.04,43.14 18.91,43.28 U2.10
I2C_PW  (via drill 0.3)
  Top 0.15: 155.67,9.56 156.16,9.56 C2.1 156.23,9.56 157.41,9.56 R1_PINH.2 157.54,9.56 158.72,9.56 R2_PINH.2 | 155.67,9.56 154.98,9.56 C1.1 | 155.81,17.24 155.81,15.65 156.23,15.23 156.23,13.85 SENSOR2.8 | 155.81,17.24 156.02,17.45 156.57,17.45 157.06,16.97 157.06,16.76 SENSOR2.2 157.13,16.69 157.13,16.41 157.82,15.72 157.82,13.85 SENSOR2.6 | v31.37,52.98 29.02,52.98 21.47,60.52 21.47,60.8 U2.17 | v155.67,17.31 155.74,17.24 155.81,17.24 | v155.67,11.22 155.67,9.56
  Bottom 0.15: v31.37,52.98 55.26,52.98 56.02,52.22 120.77,52.22 v155.67,17.31 v155.67,11.22
INT_RTC  (via drill 0.3)
  Top 0.15: R1_PINH1.1 90.16,65.44 88.71,65.44 84.9,69.25 84,69.25 83.72,68.97 83.72,67.73 81.92,65.93 81.92,65.65 U3.3 81.85,65.58 81.85,65.23 74.1,57.48 42.94,57.48 42.45,56.99 37.88,56.99 35.32,54.43 33.45,54.43 30.47,51.45 19.46,51.45 16.34,48.34 16.34,43.35 U2.8 16.27,43.28 v16.27,39.54 | v3.81,27.08 3.81,20.36 2.56,19.11 TP15.TP
  Bottom 0.15: v3.81,27.08 v16.27,39.54
IO/BOOT  (via drill 0.3)
  Top 0.15: C6.1 67.24,108.17 66,108.17 65.79,108.38 BOOT_BUTTON.3 65.72,108.44 62.26,108.44 BOOT_BUTTON.4 62.19,108.38 60.66,106.85 R_BOOT.2 59.62,106.78 v59.62,104.29 | v23.96,68.63 23.96,60.87 U2.15
  Bottom 0.15: v59.62,104.29 v23.96,68.63
IO/CHANGE
  Top 0.15: C10.1 27.91,108.17 25.97,108.17 25.76,108.38 CHANGE_BUTTON.3 25.69,108.44 22.3,108.44 CHANGE_BUTTON.4 22.23,108.44 20.64,106.85 20.36,106.85 R_CHANGE.2 20.29,106.78 14.06,100.55 14.06,67.1 13.85,66.89 13.85,60.87 U2.23
MISO  (via drill 0.3)
  Top 0.15: 75.31,30.09 71.88,26.66 71.88,24.17 D12.1 71.88,24.1 72.37,23.61 72.37,20.36 TP6.TP | 75.31,30.09 76.17,30.95 76.17,31.09 R8.1 | v40.16,55.26 41.76,55.26 U1.2 | v16.83,57.76 11.49,57.76 8.73,60.52 8.73,60.8 U2.27 8.73,60.87 8.73,67.59 11.56,70.43 11.56,100.48 9.76,102.28 5.61,102.28 4.09,100.76 4.09,94.39 4.71,93.76 5.05,93.76 J4.P7 | v51.45,53.95 75.31,30.09
  Bottom 0.15: v16.83,57.76 37.67,57.76 v40.16,55.26 40.23,55.26 41.55,53.95 v51.45,53.95
MOSI  (via drill 0.3)
  Top 0.15: J1.14 84.28,15.37 84.28,14.96 83.45,14.13 79.78,14.13 76.17,17.73 76.17,21.12 74.24,23.06 74.24,23.89 74.51,24.17 75.41,24.17 77.84,26.59 77.84,30.4 76.87,31.37 76.87,31.58 54.02,54.43 51.31,54.43 49.65,52.77 U1.5 49.58,52.7 49.58,41.83 v46.33,38.57 | 17.73,38.16 17.04,38.16 16.45,38.74 | 17.73,38.16 19.46,38.16 25.21,32.41 39.33,32.41 R7.1 39.33,32.48 v40.23,32.48 | 17.73,38.16 17.73,37.53 30.61,24.65 39.33,24.65 D11.1 | v4.36,88.57 5.05,89.26 J4.P3 | v8.31,59.14 8.31,59 15.03,52.28 15.03,43.35 U2.7 15.06,42.34 14.81,42.09 14.81,40.38 16.45,38.74 | v3.32,25.62 2.56,24.86 2.56,24.17 TP7.TP | 16.45,38.74 v16.55,38.85
  Bottom 0.15: v4.36,88.57 4.36,63.09 v8.31,59.14 | v16.55,38.85 v3.32,25.62 | v40.23,32.48 v46.33,38.57
N$1
  Top 0.15: R2-USB.1 156.23,54.02 161.84,54.02 163.84,56.02 164.4,56.02 J2.B5
N$2  (via drill 0.3)
  Top 0.15: C1_BAT1.1 121.33,41.97 121.33,44.32 121.74,44.74 IC4.3 121.53,44.6 v120.98,45.15 | 120.98,46.67 119.46,46.67 119.39,46.74 D2.1 | 120.98,46.67 121.74,46.67 IC4.1 121.81,46.67 126.87,51.73 131.64,51.73 132.27,51.11 133.03,51.11 Q1.2 | v120.98,46.6 120.98,46.67
  Bottom 0.15: v120.98,46.6 v120.98,45.15
N$3
  Top 0.15: C4.1 99.03,33.59 97.57,33.59 95.77,31.79 D3.2 95.84,31.92 92.24,35.52 D4.1
N$4  (via drill 0.3)
  Top 0.15: v148.89,52.77 147.36,52.77 R2-USB1.2 | v162.04,53.05 164.4,53.05 J2.A5
  Bottom 0.15: v148.89,52.77 161.77,52.77 v162.04,53.05
N$5
  Top 0.15: D7.1 82.82,71.12 82.82,68.97 83.17,68.63 R_CAPACITOR.2
N$6
  Top 0.15: CHG_LED.C 117.31,57.2 113.71,57.2 R1_BAT.2
N$8
  Top 0.15: R2_BAT.2 123.2,52.77 123.2,54.91 MCP73831.5
N$9
  Top 0.15: R1_BAT.1 112.39,57.13 112.6,57.13 113.85,55.88 124.58,55.88 125.48,54.98 125.76,54.98 MCP73831.1
N$10
  Top 0.15: J1.24 79.29,15.44 79.29,19.18 75,23.48 EPD_C12.1
N$11
  Top 0.15: C_DELAY.1 53.32,98.47 51.18,98.47 50.97,98.68 IC1.5
N$12
  Top 0.15: J1.22 80.33,15.44 80.33,23.2 80.05,23.48 EPD_C10.1
N$13
  Top 0.15: EPD_C8.1 85.04,23.48 81.71,20.14 81.71,17.6 81.37,17.26 81.37,15.45 J1.20
N$15
  Top 0.15: EPD_C7.1 81.98,17.84 81.98,15.56 J1.19
N$16
  Top 0.15: J1.18 82.41,15.44 82.41,15.86 90.03,23.48 EPD_C6.1
N$18
  Top 0.15: J1.5 88.78,15.37 88.78,14.96 85.54,11.72 80.87,11.72 80.68,11.91 71.88,11.91 71.74,12.05 61.01,12.05 EPD_C2.1
N$19  (via drill 0.3)
  Top 0.15: v88.43,16.69 89.33,15.79 89.33,15.44 J1.4 | v66.06,16.07 66.06,15.51 65.86,15.3 EPD_C1.1
  Bottom 0.15: v88.43,16.69 85.66,16.69 85.32,16.34 85.32,16.07 86.49,14.89 87.39,14.89 88.22,14.06 88.22,13.78 85.04,10.6 71.53,10.6 v66.06,16.07
PREVGH  (via drill 0.3)
  Top 0.15: v84.55,25.48 85.04,25.97 85.04,36.56 83.38,38.23 83.38,39.33 D5.1 | v83.24,24.17 82.61,23.55 EPD_C9.1 80.85,21.78 80.85,15.43 J1.21
  Bottom 0.15: v83.24,24.17 v84.55,25.48
PREVGL
  Top 0.15: J1.23 79.78,15.44 79.78,21.19 77.49,23.48 EPD_C11.1 77.56,23.48 79.43,25.35 79.43,37.19 82.55,40.3 89.19,40.3 93.9,35.59 95.7,35.59 D4.2
RESE  (via drill 0.3)
  Top 0.15: J1.3 89.82,15.37 89.82,15.03 86.23,11.44 80.76,11.44 80.63,11.56 v71.61,11.56 | R3.1 63.5,19.67 v64.33,18.84 64.33,18.14 62.95,16.76 61.63,16.76 Q3.2
  Bottom 0.15: v64.33,18.84 v71.61,11.56
RESE'
  Top 0.15: SJ1.2 57.89,10.18 57.82,10.25 57.82,13.92 R2.2 57.89,13.92 58.59,13.92 60.8,16.14 60.8,16.98 62.16,18.34 63.45,18.34 R3.2
RESET  (via drill 0.3)
  Top 0.15: RESET_BUTTON.4 47.3,108.44 50.69,108.44 RESET_BUTTON.3 50.76,108.38 50.97,108.17 53.32,108.17 C5.1 53.39,108.1 53.39,107.89 54.02,107.27 54.02,106.44 50.69,103.11 48.13,103.11 | 48.13,103.11 48.13,98.75 IC1.1 48.06,98.75 47.64,98.33 v47.3,98.33 | 48.13,103.11 44.46,106.78 R_RESET.2 | v9.76,44.46 9.97,44.25 9.97,43.35 U2.3
  Bottom 0.15: v9.76,44.46 9.76,60.8 v47.3,98.33
RTC_RST
  Top 0.15: U2.16 22.71,60.8 22.71,60.52 23.41,59.83 60.04,59.83 64.54,64.33 79.71,64.33 80.61,65.23 80.61,65.58 U3.4
RX
  Top 0.15: TP2.TP 12.67,67.24 12.25,66.82 12.25,62.04 12.52,61.77 U2.24
SCK  (via drill 0.3)
  Top 0.15: v83.58,13.64 84.83,14.89 84.83,15.37 J1.13 | v47.71,23.89 47.02,24.58 D10.1 46.95,24.58 46.33,23.96 30.82,23.96 13.54,41.23 13.54,42.09 13.79,42.34 U2.6 13.78,43.35 13.78,43.56 13.02,44.32 10.94,44.32 8.79,46.47 v8.79,47.71 | v47.02,28.53 47.02,31.09 R6.1 | v46.81,39.68 46.81,50.9 49.58,53.67 49.58,53.95 U1.6 | v6.23,91.34 6.09,91.48 5.12,91.48 J4.P5 | v7.62,48.89 6.51,47.78 6.51,43.21 0.41,37.12 0.41,34.28 2.49,32.2 2.49,29.22 TP8.TP
  Bottom 0.15: v83.58,13.64 71.26,13.64 61.01,23.89 v47.71,23.89 47.71,23.96 47.02,24.65 v47.02,28.53 47.02,28.6 46.81,28.81 v46.81,39.68 | v6.23,91.34 6.23,62.05 8.79,59.49 8.79,48.89 | v8.79,47.71 8.79,48.89 | 8.79,48.89 v7.62,48.89
SCL  (via drill 0.3)
  Top 0.15: v18.97,59.21 17.66,60.52 17.66,60.8 U2.20 | v82.55,55.12 82.75,55.12 82.82,55.05 83.52,55.05 84.42,55.95 84.42,56.3 U3.16 | v159.48,8.93 158.79,8.24 R2_PINH.1 | v159.34,16.07 158.72,16.69 SENSOR2.4 | v140.78,55.05 135.94,59.9 135.66,59.9 U4.7 | v165.23,30.61 165.23,20.84 J3.4
  Bottom 0.15: v18.97,59.21 78.46,59.21 81.96,55.71 | v82.55,55.12 81.96,55.71 | v159.48,8.93 159.48,15.93 v159.34,16.07 159.34,24.65 165.23,30.54 v165.23,30.61 v140.78,55.05 140.72,55.05 138.29,57.48 102.42,57.48 97.71,62.19 84,62.19 83.52,61.7 83.52,61.15 83.72,60.94 83.72,57.48 81.96,55.71
SDA  (via drill 0.3)
  Top 0.15: v19.74,59.69 18.91,60.52 18.91,60.8 U2.19 | v83.24,57.69 83.24,56.37 U3.15 | 156.99,17.8 151.94,17.8 142.24,8.1 142.24,7.13 143,6.37 155.47,6.37 157.27,8.17 157.47,8.17 R1_PINH.1 | 156.99,17.8 157.82,16.97 157.82,16.76 SENSOR2.3 | v140.78,55.68 136.08,60.39 135.66,60.39 U4.8 | v164.33,32.13 164.33,20.43 164.95,19.8 165.23,19.8 J3.3 | v160.66,21.54 156.99,17.87 156.99,17.8
  Bottom 0.15: 81.23,59.69 v19.74,59.69 | v83.24,57.69 81.23,59.69 | v160.66,21.54 160.66,25.41 165.72,30.47 165.72,30.82 164.4,32.13 v164.33,32.13 v140.78,55.68 140.72,55.68 133.93,62.46 83.86,62.46 83.24,61.84 83.24,61.77 81.23,59.76 81.23,59.69
SRC  (via drill 0.3)
  Top 0.15: C4.2 99.03,34.9 94.18,34.9 90.14,38.94 87.27,38.94 D5.2 86.84,39.4 84.62,39.4 84,40.03 82.68,40.03 82.12,39.46 82.12,34.98 82.75,34.35 L1.1 82.75,34.28 82.75,32.48 81.18,30.91 81.1,30.91 80.81,30.62 80.81,30.33 80.95,30.19 80.95,29.02 v80.68,28.74 | v70.91,28.74 61.01,18.84 Q3.3
  Bottom 0.15: v70.91,28.74 v80.68,28.74
SS_SD
  Top 0.15: 7.2,101.04 6.37,101.04 D8.1 | 7.2,101.04 8.86,101.04 R10.1 | 7.2,101.04 7.2,90.03 5.54,88.36 5.54,88.22 J4.P2 5.54,88.16 6.37,87.32 6.37,60.04 8.1,58.31 8.1,46.74 11.22,43.63 11.22,43.35 U2.4
TX
  Top 0.15: U2.25 11.22,60.87 11.22,66.2 10.18,67.24 TP1.TP
USB_D+  (via drill 0.3)
  Top 0.15: v144.94,57.96 149.86,53.05 D1.1 | v64.06,63.23 63.85,63.23 58.38,57.76 38.02,57.76 v35.18,54.91 | v34.21,53.95 34.21,53.62 26.74,46.15 26.49,46.15 23.95,43.61 U2.14
  Bottom 0.15: v144.94,57.96 140.44,57.96 135.18,63.23 v64.06,63.23 | v34.21,53.95 v35.18,54.91
USB_D-  (via drill 0.3)
  Top 0.15: v148.68,51.18 149.86,51.18 D1.3 | v21.81,44.46 22.64,43.63 22.64,43.35 U2.13
  Bottom 0.15: v148.68,51.18 145.91,51.18 134.34,62.74 14.96,62.74 11.22,59 11.22,55.05 v21.81,44.46
VBAT
  Top 0.15: U4.3 133.65,59.49 133.65,59.9 U4.2 133.58,59.97 132.54,59.97 132.2,60.32 129.57,60.32 C2_BAT.1 129.5,60.32 126.03,56.85 MCP73831.3 125.83,56.78 126.03,56.78 129.64,53.18 132.06,53.18 Q1.3 132.13,53.18 139.54,53.18 148.54,62.19 TP3.TP
VBUS  (via drill 0.3)
  Top 0.3: C4_USB.1 153.11,48.13 153.11,49.51 C5_USB.1 | D1.5 152.42,52.01 153.32,52.01 153.94,51.38 153.94,50.41 153.18,49.65 C5_USB.1 | 133.06,49.76 136.08,46.74 147.85,46.74 | 133.06,49.76 131.78,51.04 131.16,51.04 Q1.1 | 147.85,46.74 148.82,45.77 PFMF.050.1.2 | 119.66,54.57 120.15,54.57 122.64,52.08 126.66,52.08 126.73,52.15 133.24,52.15 133.72,51.66 133.72,50.41 133.06,49.76 | 119.66,54.57 118.76,54.57 C1_BAT.1 | C5_USB.1 152.9,49.58 152.21,50.28 151.24,50.28 147.85,46.88 147.85,46.74 | D2.2 119.32,44.74 119.04,45.01 116.89,45.01 R1_PWRUSB.2 116.75,45.15 115.99,45.15 111.7,49.44 111.7,57.69 111.91,57.89 118.14,57.89 118.76,57.27 CHG_LED.A 118.9,57.13 119.66,57.13 | 119.66,57.13 122.85,57.13 123.13,56.85 MCP73831.4 123.27,56.92 129.91,63.57 149.09,63.57 150.41,62.26 152.35,62.26 TP14.TP | v119.66,55.12 119.66,54.57 | v119.66,56.99 119.66,57.13
  Bottom 0.3: v119.66,56.99 v119.66,55.12
VRTC
  Top 0.15: C10_SUPERCAP.2 91.41,58.24 91,57.82 88.92,57.82 C8.1 88.92,57.89 88.92,58.17 | 88.92,58.17 88.92,62.74 84.48,67.17 84.48,68.56 R_CAPACITOR.1 | 88.92,58.17 83.1,58.17 81.92,56.99 81.92,56.37 U3.14
VUSB
  Top 0.3: J2.A4 164.4,51.8 164.4,52.01 J2.B9 164.26,52.08 156.85,52.08 155.47,53.46 155.47,55.75 156.23,56.51 164.26,56.51 J2.B4 | J2.B4 164.4,56.58 164.4,56.78 J2.A9 | PFMF.050.1.1 153.39,45.77 164.12,45.77 166.87,48.52 166.87,54.82 165.18,56.51 164.54,56.51 J2.B4

## Text on the board
tPlace: TX | RX | EPD_3V3_C | VBUS | VBAT | 3V3 | SCK | MOSI | MISO | INT_RTC | EPD_BUSY | EPD_3V3 | EPD_RST | EPD_DC | GND | GND | EPD_CS